# EasyEDA schematic SCH_VELOS-R1_2025-07-28.json
TITLE: VELOS R1; REV: 1; Date: 2025-07-28; Sheet: 1/1; Drawn By: Me; Company: Axyz.space
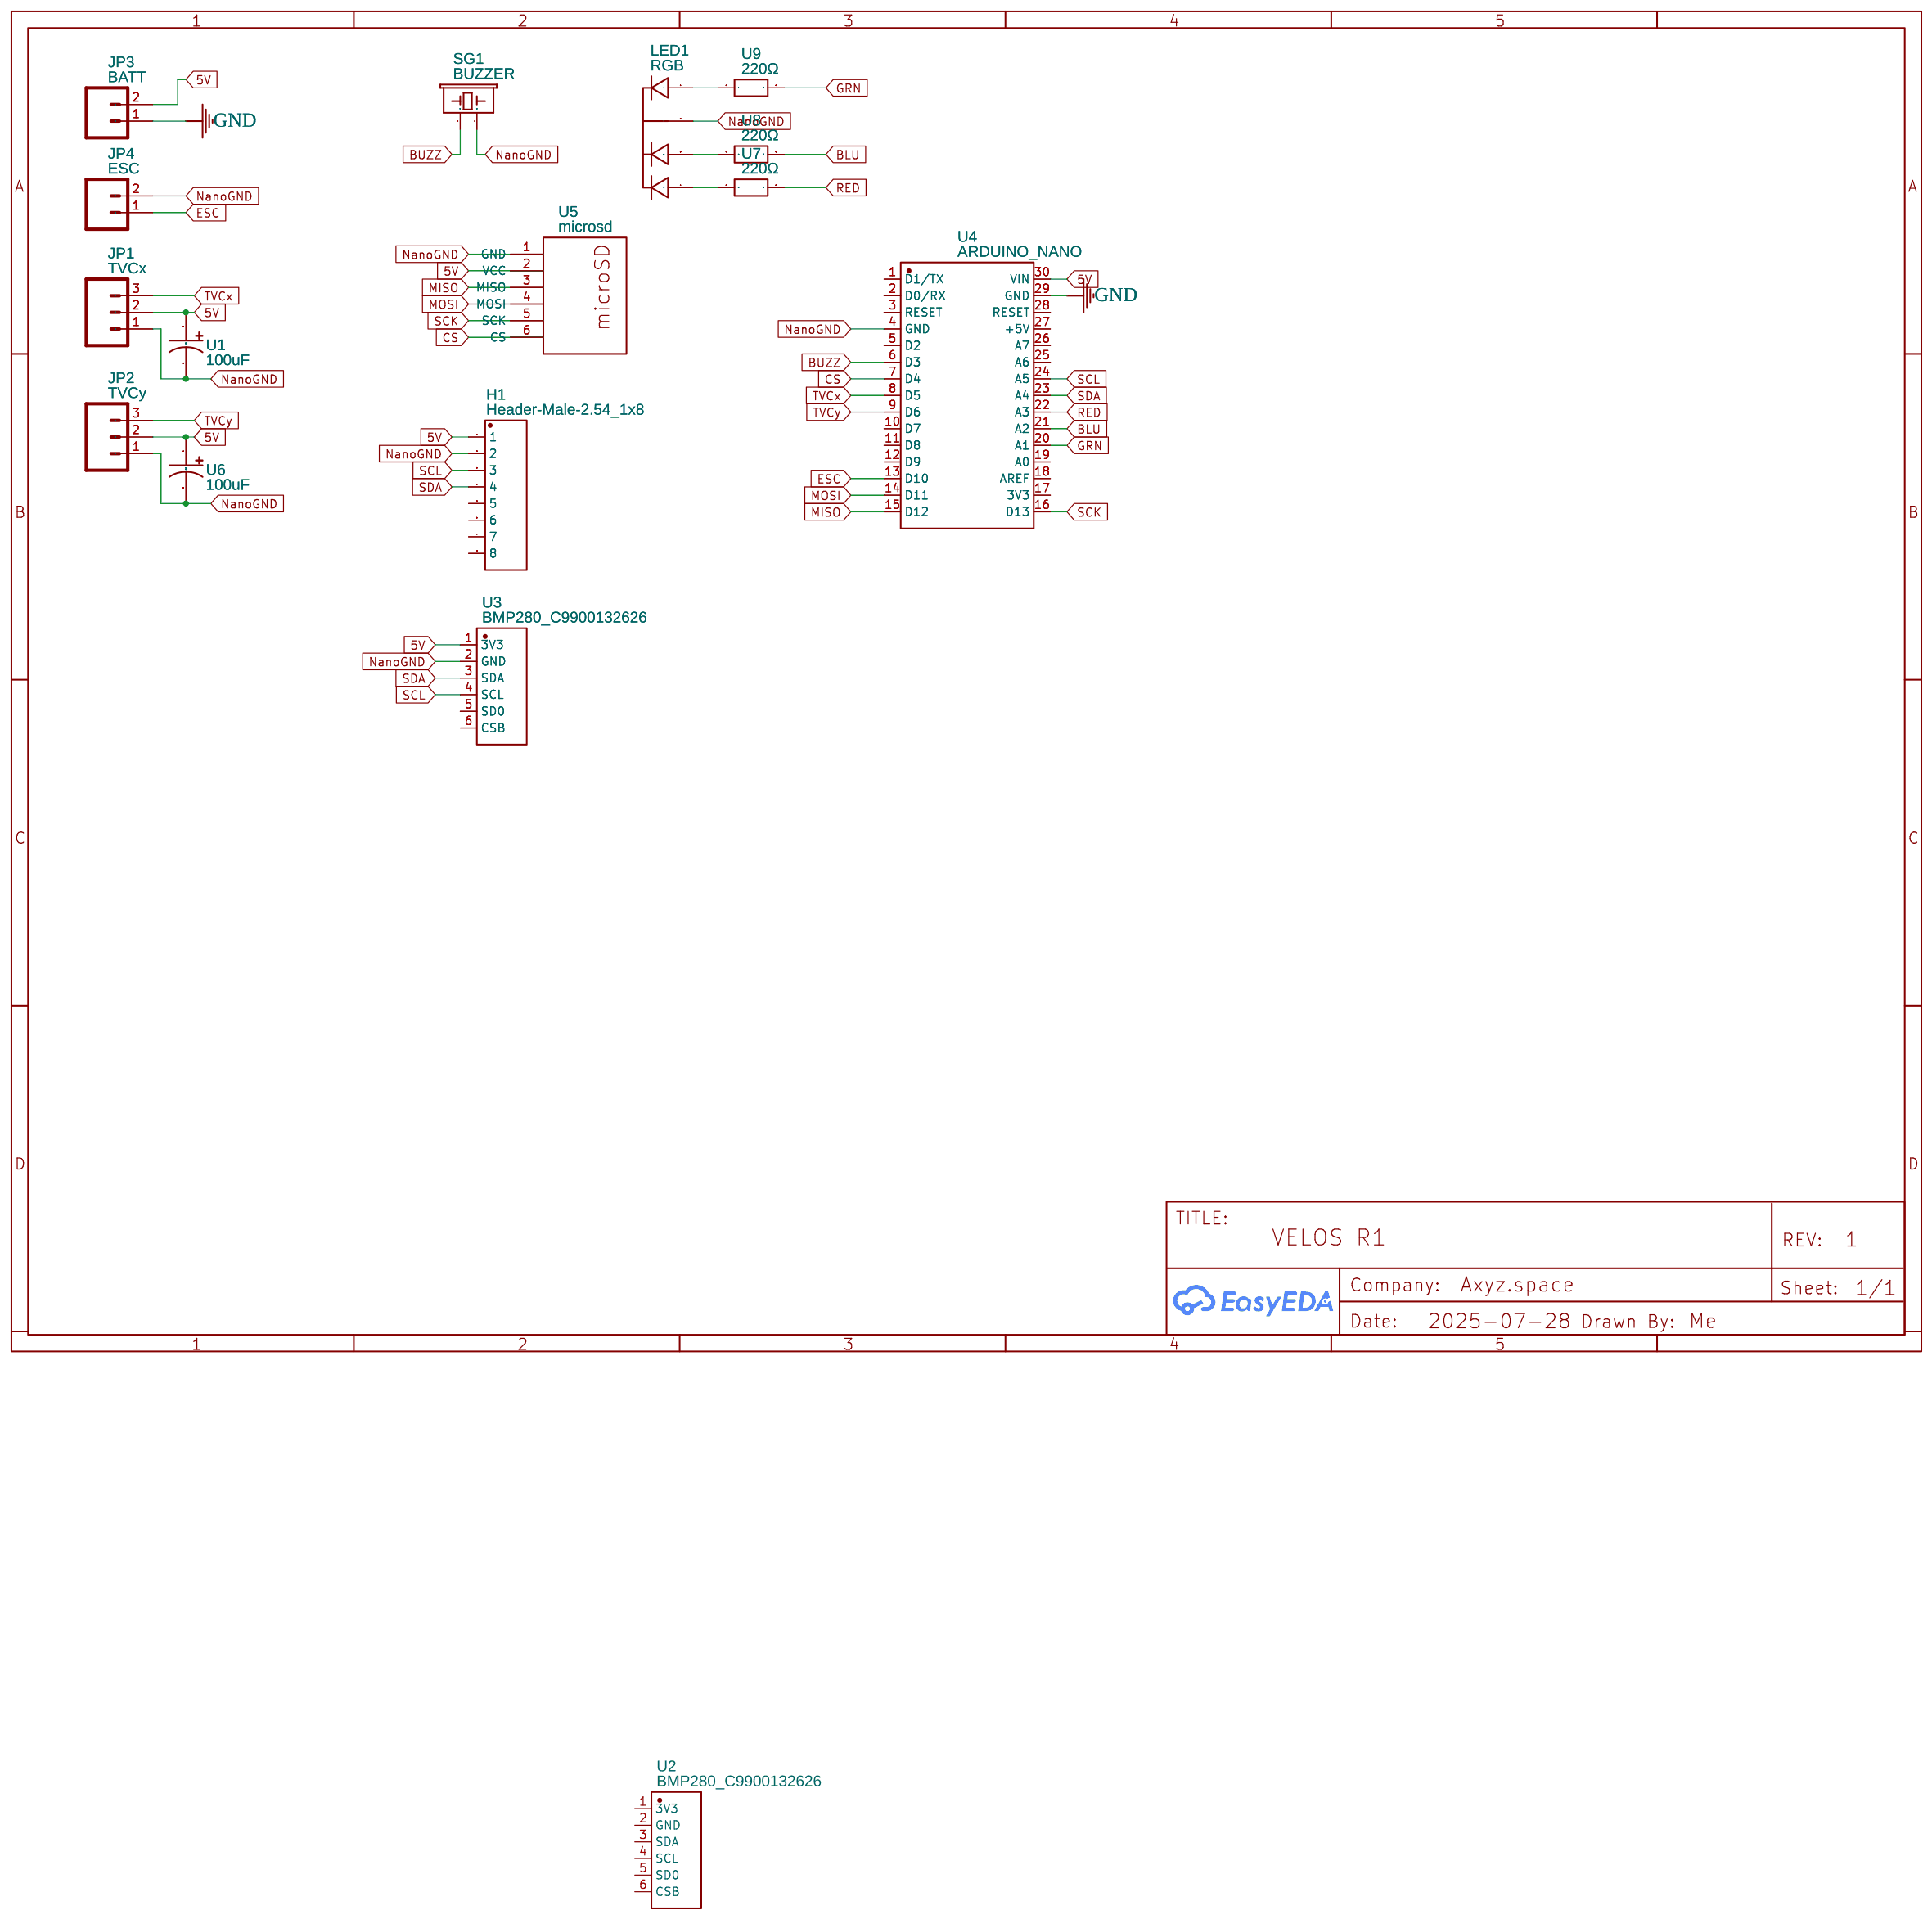
[diagram p0: schematic sheet]

## Parts
H1  Header-Male-2.54_1x8  [HDR-TH_8P-P2.54-V-M]
JP1  TVCx  [SCREWTERMINAL-5MM-3]
JP2  TVCy  [SCREWTERMINAL-5MM-3]
JP3  BATT  [SCREWTERMINAL-3.5MM-2]
JP4  ESC  [SCREWTERMINAL-3.5MM-2]
LED1  RGB  [LED-TH_4P-BD5.8-P1.30]
SG1  BUZZER  [BUZZER-12MM]
U1  100uF  [CAP-TH_BD6.3-P2.50-D1.0-FD]
U2  BMP280_C9900132626  [COMM-TH_BMP280-TH]
U3  BMP280_C9900132626  [COMM-TH_BMP280-TH]
U4  ARDUINO_NANO  [COMM-TH_ARDUINO_NANO]
U5  microsd  [MICROSD]
U6  100uF  [CAP-TH_BD6.3-P2.50-D1.0-FD]
U7  220Ω  [RES-TH_BD4.2-L11.9-P15.90-D0.8]
U8  220Ω  [RES-TH_BD4.2-L11.9-P15.90-D0.8]
U9  220Ω  [RES-TH_BD4.2-L11.9-P15.90-D0.8]

## Library data of the parts
H1 = Header-Male-2.54_1x8: Contributor: LCSC; Supplier: LCSC; Manufacturer: Ckmtw(灿科盟); Manufacturer Part: B-2100S08P-A110; Supplier Part: C124381; JLCPCB Part Class: Extended Part
JP1 JP2 = M03-SCREW-5MM: Header 3; Contributor: SparkFun
JP3 JP4 = M023.5MM: Standard 2-pin 0.1 header. Use with; Contributor: SparkFun
LED1 = TJ-L5FYTXHMCSLCRGB-A5: Contributor: LCSC; Supplier: LCSC; Supplier Part: C330759; Manufacturer: TOGIALED(统佳); JLCPCB Part Class: Extended Part
SG1 = BUZZER: Contributor: SparkFun
U1 U6 = 35ZLH100MHFC(6.3X11): Contributor: lcsc; Supplier: LCSC; Supplier Part: C3035370; Manufacturer: rubycon(红宝石); JLCPCB Part Class: Extended Part
U2 U3 = BMP280_C9900132626: Supplier: LCSC; Supplier Part: C9900132626; Manufacturer: null; Manufacturer Part: BMP280; Contributor: lcsc
U4 = ARDUINO_NANO: Contributor: lcsc; Supplier: LCSC; Supplier Part: C9900017879; Manufacturer: null; JLCPCB Part Class: Extended Part
U5 = microsd: Contributor: marspcbrocket
U7-U9 = MBE04140C2200FC100: Supplier: LCSC; Supplier Part: C3500426; Manufacturer: VISHAY(威世); Contributor: lcsc; JLCPCB Part Class: Extended Part

## Nets
5V: H1.1 JP1.2 JP2.2 JP3.2 U1.1 U3.1(3V3) U4.30(VIN) U5.2(VCC) U6.1
GND: JP3.1 U4.29(GND)
BLU: U4.21(A2) U8.2
BUZZ: SG1.+(1) U4.6(D3)
CS: U4.7(D4) U5.6(CS)
ESC: JP4.1 U4.13(D10)
GRN: U4.20(A1) U9.2
MISO: U4.15(D12) U5.3(MISO)
MOSI: U4.14(D11) U5.4(MOSI)
NanoGND: H1.2 JP1.1 JP2.1 JP4.2 LED1.2(-) SG1.-(2) U1.2 U3.2(GND) U4.4(GND) U5.1(GND) U6.2
RED: U4.22(A3) U7.2
SCK: U4.16(D13) U5.5(SCK)
SCL: H1.3 U3.4(SCL) U4.24(A5)
SDA: H1.4 U3.3(SDA) U4.23(A4)
TVCx: JP1.3 U4.8(D5)
TVCy: JP2.3 U4.9(D6)
Net-(LED1-1): LED1.1 U9.1
Net-(LED1-3): LED1.3 U8.1
Net-(LED1-4): LED1.4 U7.1

Not connected (* = marked no-connect by the designer): H1 5 6 7 8; U2 1(3V3) 2(GND) 3(SDA) 4(SCL) 5(SD0) 6(CSB); U3 5(SD0) 6(CSB); U4 1(D1/TX) 2(D0/RX) 3(RESET) 5(D2) 10(D7) 11(D8) 12(D9) 17(3V3) 18(AREF) 19(A0) 25(A6) 26(A7) 27(+5V) 28(RESET)
